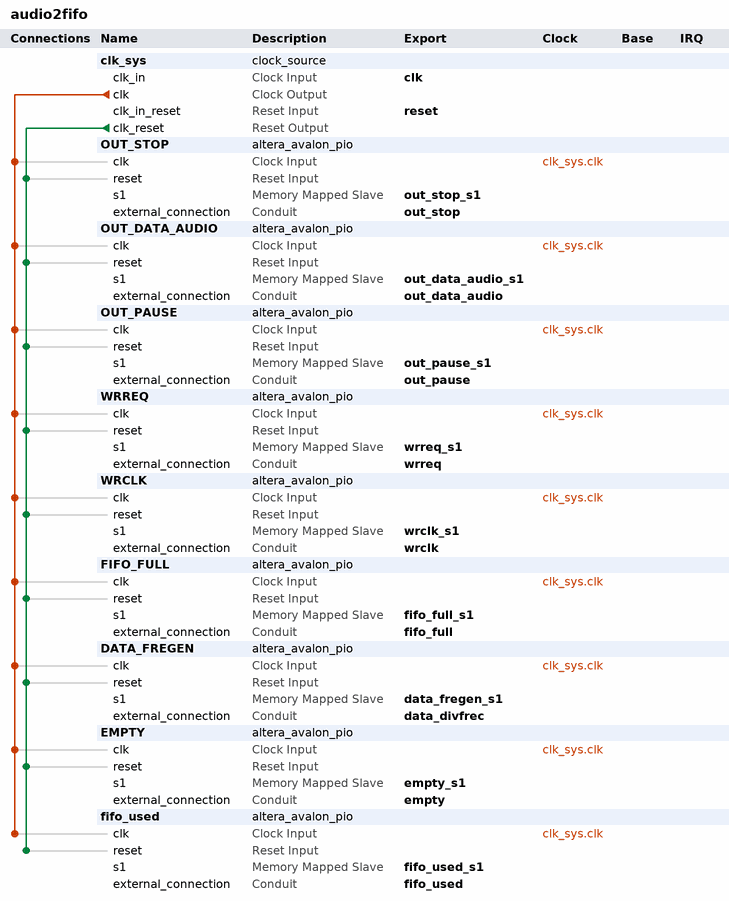
[diagram p0: system contents]
# Platform Designer (Qsys) system audio2fifo, Cyclone IV E EP4CE22F17C6
# Parameters at their usual value, and those the tool derives, are not listed.
package require -exact qsys 14.1
create_system audio2fifo
set_project_property DEVICE_FAMILY {Cyclone IV E}
set_project_property DEVICE EP4CE22F17C6

add_instance clk_sys clock_source 14.1
set_instance_parameter_value clk_sys clockFrequency 100000000
set_instance_parameter_value clk_sys resetSynchronousEdges DEASSERT

add_instance OUT_STOP altera_avalon_pio 14.1
set_instance_parameter_value OUT_STOP direction Output
set_instance_parameter_value OUT_STOP width 1

add_instance OUT_DATA_AUDIO altera_avalon_pio 14.1
set_instance_parameter_value OUT_DATA_AUDIO direction Output
set_instance_parameter_value OUT_DATA_AUDIO width 32

add_instance OUT_PAUSE altera_avalon_pio 14.1
set_instance_parameter_value OUT_PAUSE direction Output
set_instance_parameter_value OUT_PAUSE width 1

add_instance WRREQ altera_avalon_pio 14.1
set_instance_parameter_value WRREQ direction Output
set_instance_parameter_value WRREQ width 1

add_instance WRCLK altera_avalon_pio 14.1
set_instance_parameter_value WRCLK direction Output
set_instance_parameter_value WRCLK width 1

add_instance FIFO_FULL altera_avalon_pio 14.1
set_instance_parameter_value FIFO_FULL direction Input
set_instance_parameter_value FIFO_FULL width 1

add_instance DATA_FREGEN altera_avalon_pio 14.1
set_instance_parameter_value DATA_FREGEN direction Output
set_instance_parameter_value DATA_FREGEN width 32

add_instance EMPTY altera_avalon_pio 14.1
set_instance_parameter_value EMPTY direction Input
set_instance_parameter_value EMPTY width 1

add_instance fifo_used altera_avalon_pio 14.1
set_instance_parameter_value fifo_used direction Input
set_instance_parameter_value fifo_used width 12

# connections
add_connection clk_sys.clk DATA_FREGEN.clk clock
add_connection clk_sys.clk EMPTY.clk clock
add_connection clk_sys.clk FIFO_FULL.clk clock
add_connection clk_sys.clk fifo_used.clk clock
add_connection clk_sys.clk OUT_DATA_AUDIO.clk clock
add_connection clk_sys.clk OUT_PAUSE.clk clock
add_connection clk_sys.clk OUT_STOP.clk clock
add_connection clk_sys.clk WRCLK.clk clock
add_connection clk_sys.clk WRREQ.clk clock
add_connection clk_sys.clk_reset DATA_FREGEN.reset reset
add_connection clk_sys.clk_reset EMPTY.reset reset
add_connection clk_sys.clk_reset FIFO_FULL.reset reset
add_connection clk_sys.clk_reset fifo_used.reset reset
add_connection clk_sys.clk_reset OUT_DATA_AUDIO.reset reset
add_connection clk_sys.clk_reset OUT_PAUSE.reset reset
add_connection clk_sys.clk_reset OUT_STOP.reset reset
add_connection clk_sys.clk_reset WRCLK.reset reset
add_connection clk_sys.clk_reset WRREQ.reset reset

# exported interfaces
add_interface clk clock sink
set_interface_property clk EXPORT_OF clk_sys.clk_in
add_interface data_divfrec conduit end
set_interface_property data_divfrec EXPORT_OF DATA_FREGEN.external_connection
add_interface data_fregen_s1 avalon slave
set_interface_property data_fregen_s1 EXPORT_OF DATA_FREGEN.s1
add_interface empty conduit end
set_interface_property empty EXPORT_OF EMPTY.external_connection
add_interface empty_s1 avalon slave
set_interface_property empty_s1 EXPORT_OF EMPTY.s1
add_interface fifo_full conduit end
set_interface_property fifo_full EXPORT_OF FIFO_FULL.external_connection
add_interface fifo_full_s1 avalon slave
set_interface_property fifo_full_s1 EXPORT_OF FIFO_FULL.s1
add_interface fifo_used conduit end
set_interface_property fifo_used EXPORT_OF fifo_used.external_connection
add_interface fifo_used_s1 avalon slave
set_interface_property fifo_used_s1 EXPORT_OF fifo_used.s1
add_interface out_data_audio conduit end
set_interface_property out_data_audio EXPORT_OF OUT_DATA_AUDIO.external_connection
add_interface out_data_audio_s1 avalon slave
set_interface_property out_data_audio_s1 EXPORT_OF OUT_DATA_AUDIO.s1
add_interface out_pause conduit end
set_interface_property out_pause EXPORT_OF OUT_PAUSE.external_connection
add_interface out_pause_s1 avalon slave
set_interface_property out_pause_s1 EXPORT_OF OUT_PAUSE.s1
add_interface out_stop conduit end
set_interface_property out_stop EXPORT_OF OUT_STOP.external_connection
add_interface out_stop_s1 avalon slave
set_interface_property out_stop_s1 EXPORT_OF OUT_STOP.s1
add_interface reset reset sink
set_interface_property reset EXPORT_OF clk_sys.clk_in_reset
add_interface wrclk conduit end
set_interface_property wrclk EXPORT_OF WRCLK.external_connection
add_interface wrclk_s1 avalon slave
set_interface_property wrclk_s1 EXPORT_OF WRCLK.s1
add_interface wrreq conduit end
set_interface_property wrreq EXPORT_OF WRREQ.external_connection
add_interface wrreq_s1 avalon slave
set_interface_property wrreq_s1 EXPORT_OF WRREQ.s1

set_interconnect_requirement {$system} qsys_mm.clockCrossingAdapter AUTO
set_interconnect_requirement {$system} qsys_mm.maxAdditionalLatency 4

save_system audio2fifo.qsys
